# EAGLE design throwaway (EAGLE 6.5.0)
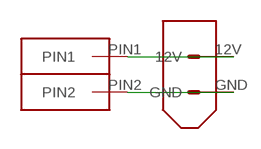
[diagram p0: schematic, sheet 1]

## Parts
U$1  ANDERSON_25A_1X2  [ANDERSON_25A_1X2]
U$3  XT60CONNECTOR  [XT60CONNECTOR]

## Nets
1: U$1.PIN1 U$3.12V
2: U$1.PIN2 U$3.GND

## Library data of the parts
U$1 = pie:ANDERSON_25A_1X2
U$3 = pie:XT60CONNECTOR: 12V XT60 power connector; PARTNUMBER: PRT-10474

## Board
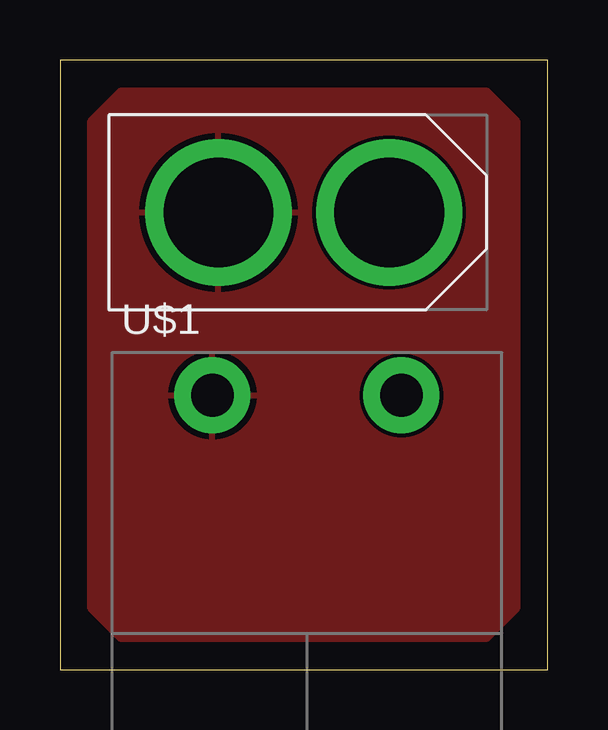
[diagram p1: board, top side]
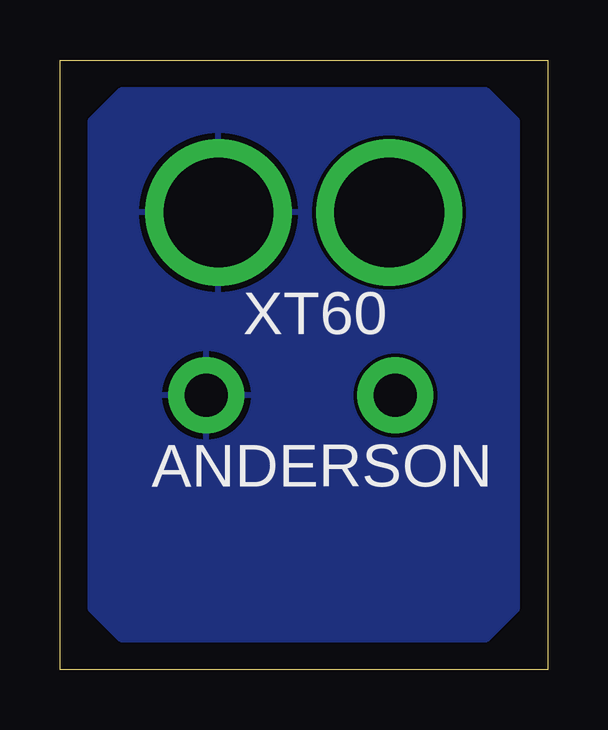
[diagram p2: board, bottom side, seen from below]

Size 20.32 x 25.4 mm. Coordinates in mm from the lower left corner, seen from the top.
Outline: 0,0 20.32,0 20.32,25.4 0,25.4 0,0
Copper layers (1*16): Top 2mil / dielectric 9mil / Bottom 2mil
Design rules "advancedcircuits-33each-pie": minimum track width 6mil, minimum drill 15mil, track to track 6mil, track to pad 10mil, pad to pad 6mil, via to via 6mil, smd to smd 6mil, copper to edge 25mil, drill to drill 7mil, minimum pad ring 7mil, minimum via ring 7mil, stop-mask expansion 3mil, vias tented up to drill 0mil, thermal gap 10mil

### Footprints (pad centres in the part's own frame; a part is rotated, then mirrored left to right if it is on the bottom)
ANDERSON_25A_1X2 = drill 1.778 pad 3.175: PIN1 0,0; PIN2 7.874,0
XT60CONNECTOR = drill 4.572 pad 6.096: 12V -3.556,0; GND 3.556,0

### Placement (x,y rotation side)
U$1  6.35,11.43 0 top
U$3  10.16,19.05 0 top

### Tracks (layer width: path | path; a pad name or v marks a point on that pad's centre or on a via)
1
  pour Top: 2.54,24.13 17.78,24.13 19.05,22.86 19.05,2.54 17.78,1.27 2.54,1.27 1.27,2.54 1.27,22.86
2
  pour Bottom: 2.54,24.13 17.78,24.13 19.05,22.86 19.05,2.54 17.78,1.27 2.54,1.27 1.27,2.54 1.27,22.86

### Text on the board
bNames: XT60 | ANDERSON